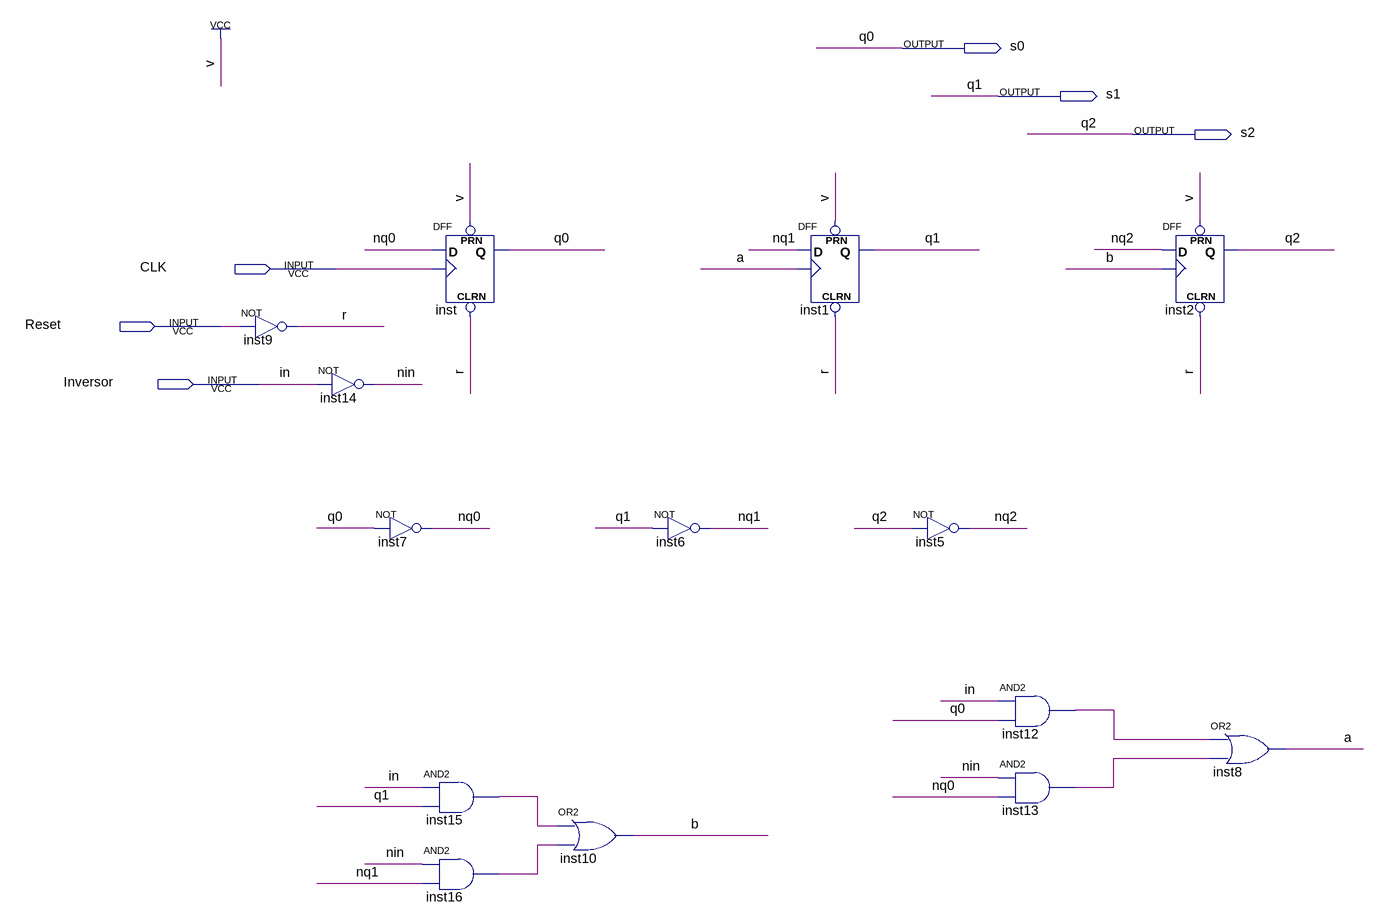
[diagram p0: schematic sheet]
// Quartus schematic Contador_inversor.bdf as structural Verilog: 14 symbols, 6 pins
module Contador_inversor (
  input  CLK,
  input  Reset,
  input  Inversor,
  output s0,
  output s1,
  output s2
);

  wire a, b, inst12_out, inst13_out, inst15_out, inst16_out, nin, nq0, nq1, nq2, r;

  not inst9 (r, Reset);
  not inst14 (nin, Inversor);
  not inst7 (nq0, s0);
  DFF inst (.CLRN(r), .CLK(CLK), .D(nq0), .PRN(1'b1), .Q(s0));
  and inst15 (inst15_out, Inversor, s1);
  and inst16 (inst16_out, nin, nq1);
  or inst10 (b, inst15_out, inst16_out);
  not inst6 (nq1, s1);
  DFF inst1 (.CLRN(r), .CLK(a), .D(nq1), .PRN(1'b1), .Q(s1));
  not inst5 (nq2, s2);
  and inst12 (inst12_out, Inversor, s0);
  and inst13 (inst13_out, nin, nq0);
  DFF inst2 (.CLRN(r), .CLK(b), .D(nq2), .PRN(1'b1), .Q(s2));
  or inst8 (a, inst12_out, inst13_out);

  // Other names for the same wires on the sheet: in = Inversor; q0 = s0; q1 = s1; q2 = s2
endmodule
